# Altium schematic sheet RIP_AFE.SchDoc: SomniLink RIP AFE – Rev A
size A4; Date: 21/08/2026; DrawnBy: Caoilte Donohoe; DocumentNumber: SM-RIP-AFE-001; Revision: A; SheetNumber: 1; SheetTotal: 1
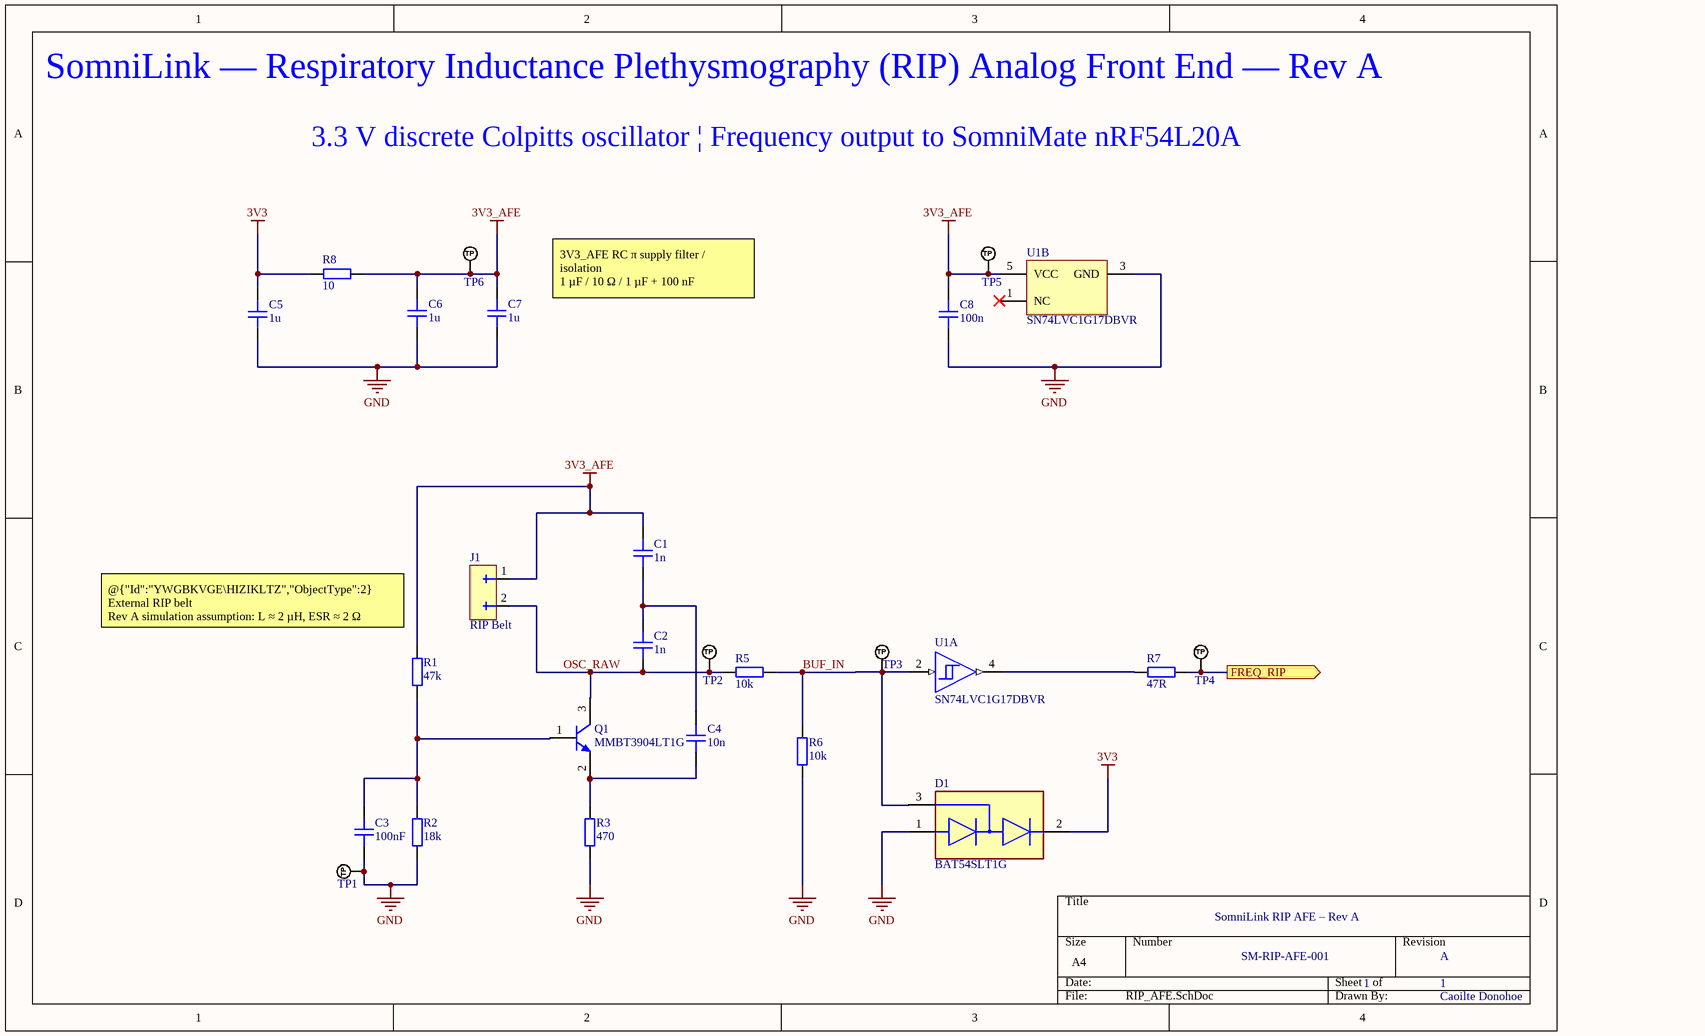
[diagram p0: RIP_AFE.SchDoc]

## Parts
C1  1n  [CAP_0603]
C2  1n  [CAP_0603]
C3  100nF  [CAP_0603]
C4  10n  [CAP_0603]
C5  1u  [CAP_0603]
C6  1u  [CAP_0603]
C7  1u  [CAP_0603]
C8  100n  [CAP_0603]
D1  BAT54SLT1G  [FP-318-08-MFG]
J1  RIP Belt
Q1  MMBT3904LT1G  [ONSC-SOT-23-3-318-08_V]
R1  47k  [RES_0603]
R2  18k  [RES_0603]
R3  470  [RES_0603]
R5  10k  [RES_0603]
R6  10k  [RES_0603]
R7  47R  [RES_0603]
R8  10  [RES_0603]
TP1  TP_NOBOM  [PAD_RND_1MM]  (value not drawn)  (no BOM)
TP2  TP_NOBOM  [PAD_RND_1MM]  (value not drawn)  (no BOM)
TP3  TP_NOBOM  [PAD_RND_1MM]  (value not drawn)  (no BOM)
TP4  TP_NOBOM  [PAD_RND_1MM]  (value not drawn)  (no BOM)
TP5  TP_NOBOM  [PAD_RND_1MM]  (value not drawn)  (no BOM)
TP6  TP_NOBOM  [PAD_RND_1MM]  (value not drawn)  (no BOM)
U1  SN74LVC1G17DBVR  [DBV0005A_M]  (parts A,B of 2)

## Ports
FREQ_RIP (out)

## Nets
3V3: C5.2 D1.2(C) R8.1
3V3_AFE: C1.2 C6.2 C7.2 C8.2 J1.1 R1.2 R8.2 TP5.1(TP) TP6.1(TP) U1.5(VCC)
GND: C3.1 C5.1 C6.1 C7.1 C8.1 D1.1(A) R2.1 R3.1 R6.1 TP1.1(TP) U1.3(GND)
BUF_IN: D1.3(CATHODE/ANODE) R5.1 R6.2 TP3.1(TP) U1.2(A)
FREQ_RIP: R7.2 TP4.1(TP) ; port FREQ_RIP
OSC_RAW: C2.1 J1.2 R5.2 TP2.1(TP)
NetC1_1: C1.1 C2.2 C4.2
NetC3_2: C3.2 R1.1 R2.2
NetC4_1: C4.1 Q1.2(E) R3.2
NetR7_1: R7.1 U1.4(Y)

Not connected (* = marked no-connect by the designer): Q1 1(B) 3(C); U1 1(NC)*

## Notes on the sheet
- SomniLink — Respiratory Inductance Plethysmography (RIP) Analog Front End — Rev A
- 3.3 V discrete Colpitts oscillator | Frequency output to SomniMate nRF54L20A
- 3V3_AFE RC π supply filter / isolation
  1 µF / 10 Ω / 1 µF + 100 nF
- (near R1) @{"Id":"YWGBKVGE\HIZIKLTZ","ObjectType":2} External RIP belt
  Rev A simulation assumption: L ≈ 2 µH, ESR ≈ 2 Ω
  Values provisional until physical belt characterisation
- 1

## Library data of the parts
C1-C8 = CAP_0603: Capacitor SMD 0603; Manufacturer: *; Manufacturer Part Number: *; Distributor Link: *; LCSC: *; Rating: *; Dielectric: *
D1 = CMP-1055-00536-2: DIODE ARRAY SCHOTTKY 30V SOT23-3; Peak Reverse Current: 2uA; Element Configuration: Dual; Max Forward Surge Current (Ifsm): 600mA; Forward Voltage: 800mV; Recovery Time: 5ns; Peak Non-Repetitive Surge Current: 1A; Capacitance: 10pF; Power Dissipation: 225mW; Average Rectified Current: 200mA; Height: 0.94mm; Radiation Hardening: No; Width: 1.3mm; Number of Pins: 3; Max Repetitive Reverse Voltage (Vrrm): 30V; Package Quantity: 3000; Contact Plating: Tin; Case/Package: SOT-23-3; Length: 2.9mm; Max Reverse Voltage (DC): 30V; Reverse Recovery Time: 5ns; Lead Free: Lead Free; REACH SVHC: No SVHC; Max Operating Temperature: 150°C; Max Reverse Leakage Current: 2uA; Voltage Rating (DC): 30V; Max Surge Current: 600mA; Forward Current: 200mA; Packaging: Tape and Reel; Halogen Free: Halogen Free; Min Operating Temperature: -55°C; Current Rating: 200mA
J1 = CONN_2PIN_GENERIC: Generic 2-Pin RIP Belt Interface
Q1 = CMP-1048-00631-1: General Purpose Transistor, NPN Silicon, 3-Pin SOT-23, Pb-Free, Tape and Reel; Manufacturer: On Semiconductor; IC Continuous (A): 0.2; fT Min (MHz): 300; ComponentLink2Description: Datasheet; Polarity: NPN; PackageDescription: 3-Pin Small Outline Transistor, Body 2.92 x 1.3 mm, Pitch 0.95 mm; ComponentLink2URL: http://www.onsemi.cn/pub_link/Collateral/MMBT3904LT1-D.PDF; DatasheetVersion: Rev. 12; Mounting Technology: Surface Mount; PartNumber: MMBT3904LT1G; ComponentLink1URL: http://www.onsemi.com/; ComponentLink3Description: Package Specification; ComponentLink1Description: Manufacturer URL; PackageVersion: Rev. AP, 11/2009; PackageReference: SOT-23-3-318-08; Packing: Tape and Reel; ComponentLink3URL: http://www.onsemi.cn/pub_link/Collateral/318-08.PDF; RoHS: TRUE
R1-R3 R5-R8 = RES_0603: Resistor SMD 0603; Manufacturer: *; Manufacturer Part Number: *; Distributor Link: *; LCSC: *
TP1-TP6 = TEST_POINT_RND_1MM: Test Point Round 1mm (NO BOM)
U1 = CMP-0859-00033-4: Single Schmitt-Trigger Buffer, DBV0005A, LARGE T&R; Manufacturer: Texas Instruments; Output Drive (IOL/IOH)(Max)(mA): 32/-32; Technology Family: LVC; ICC @ Nom Voltage(Max)(mA): 0.01; VCC(Min)(V): 1.65; F @ Nom Voltage(Max)(Mhz): 150; Schmitt Trigger: Yes; Voltage(Nom)(V): 1.8,2.5,3.3,5; 3-State Output: No; Bits(#): 1; VCC(Max)(V): 5.5; Input Type: CMOS/TTL; Logic: True; tpd @ Nom Voltage(Max)(ns): 11,6.5,5.5,5; Output Type: CMOS; Rating: Catalog; Sub-Family: Non-Inverting Buffer/Driver; PackageReference: DBV0005A; DatasheetVersion: SCES351V; Generic Part Number: SN74LVC1G17; Operating Temperature Range(C): -40 to 125,-40 to 85